# Altium schematic sheet esp8266_hat.SchDoc
size 254 x 177 mm
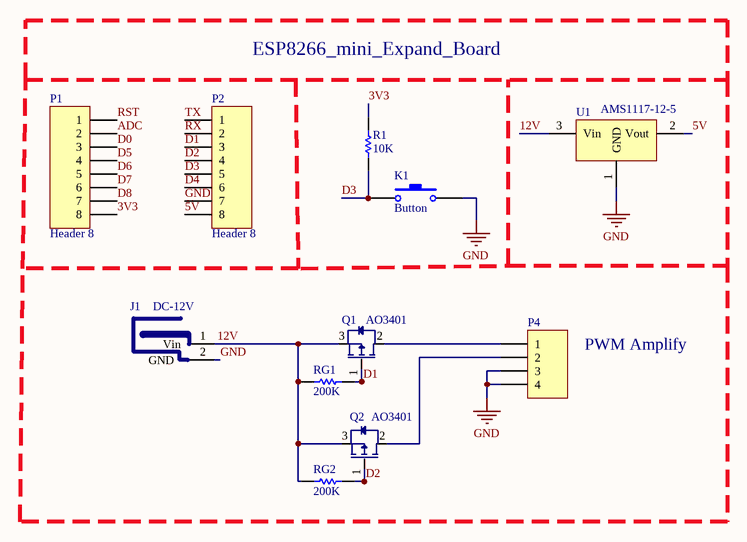
[diagram p0: esp8266_hat.SchDoc]

## Parts
J1  DC-12V  [DC-Jack]
K1  Button  [KEY_2]
P1  Header 8  [HDR1X8]
P2  Header 8  [HDR1X8]
P4  Header 4  [HDR1X4]  (value not drawn)
Q1  AO3401  [SOT23]
Q2  AO3401  [SOT23]
R1  10K  [0805_r]
RG1  200K  [0805_r]
RG2  200K  [0805_r]
U1  AMS1117-12-5  [SOT-223]

## Nets
GND: J1.2(GND) K1.2 P2.7 P4.3 P4.4 U1.1(GND)
3V3: P1.8 R1.2
5V: P2.8 U1.2(Vout)
12V: J1.1(Vin) Q1.3(S) Q2.3(S) RG1.2 RG2.2 U1.3(Vin)
ADC: P1.2
D0: P1.3
D1: P2.3 Q1.1(G) RG1.1
D2: P2.4 Q2.1(G) RG2.1
D3: K1.1 P2.5 R1.1
D4: P2.6
D5: P1.4
D6: P1.5
D7: P1.6
D8: P1.7
RST: P1.1
RX: P2.2
TX: P2.1
NetP4_1: P4.1 Q1.2(D)
NetP4_2: P4.2 Q2.2(D)

## Notes on the sheet
- ESP8266_mini_Expand_Board
- PWM Amplify

## Library data of the parts
J1 = DC-2.5x2.1-005: DC-Jack-5.5x2.1mm
K1 = KEY_2: Switch; Published: 24-Mar-1999; LatestRevisionDate: 17-Jul-2002; LatestRevisionNote: Re-released for DXP Platform.; PackageReference: SPST-2; Publisher: Altium Limited
P1 P2 = Header 8: Header, 8-Pin; LatestRevisionDate: 17-Jul-2002; LatestRevisionNote: Re-released for DXP Platform.; Publisher: Altium Limited
P4 = Header 4: Header, 4-Pin; LatestRevisionDate: 17-Jul-2002; LatestRevisionNote: Re-released for DXP Platform.; Publisher: Altium Limited
Q1 Q2 = AO3401: PMOS,30V,4A
R1 RG1 RG2 = RES: Resistor; Value: 1K; Published: 8-Jun-2000; Revision: July-2002: Re-released for DXP Platform.; Publisher: Altium Limited
U1 = AMS1117: 3.3V电压转换器AMS1117